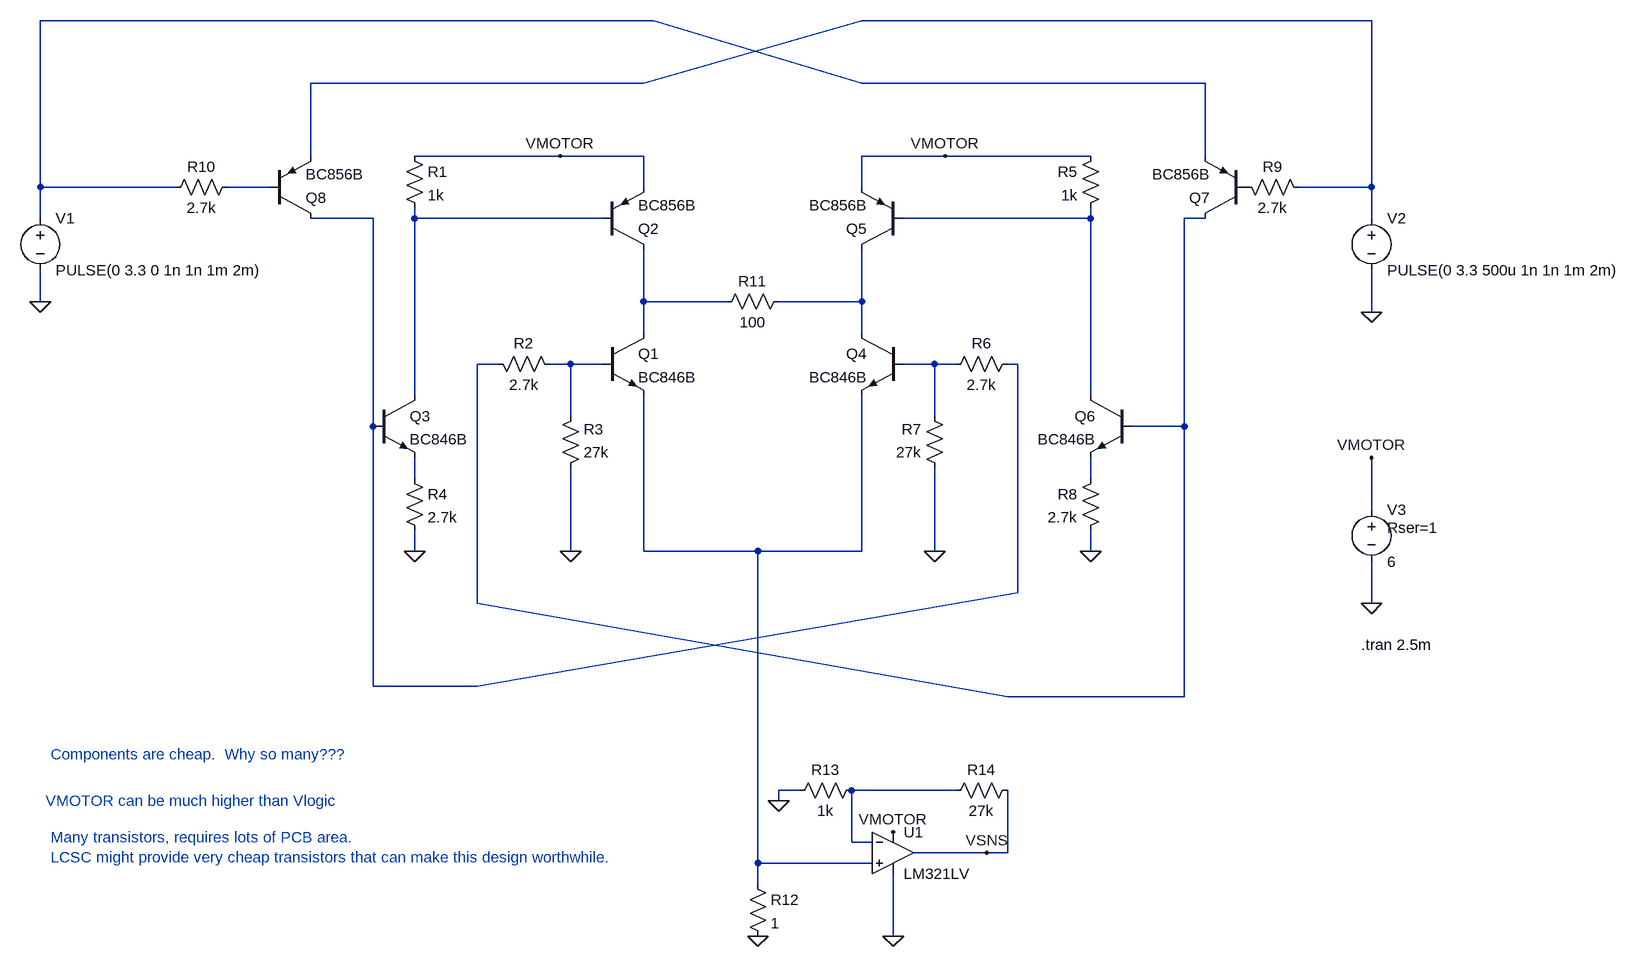
[diagram p0: schematic motor_driver.asc]
motor_driver.asc, the LTspice schematic file:
Version 4
SHEET 1 2836 1124
WIRE 208 -304 -736 -304
WIRE 1312 -304 528 -304
WIRE 192 -208 528 -304
WIRE 192 -208 -320 -208
WIRE 528 -208 208 -304
WIRE 1056 -208 528 -208
WIRE -320 -96 -320 -208
WIRE 64 -96 -160 -96
WIRE 192 -96 64 -96
WIRE 656 -96 528 -96
WIRE 880 -96 656 -96
WIRE 1056 -96 1056 -208
WIRE -736 -48 -736 -304
WIRE -528 -48 -736 -48
WIRE -384 -48 -448 -48
WIRE 192 -48 192 -96
WIRE 528 -48 528 -96
WIRE 1312 -48 1312 -304
WIRE 1312 -48 1200 -48
WIRE -736 0 -736 -48
WIRE -224 0 -320 0
WIRE -160 0 -160 -16
WIRE 128 0 -160 0
WIRE 880 0 880 -16
WIRE 880 0 592 0
WIRE 1056 0 1024 0
WIRE 1312 0 1312 -48
WIRE -736 128 -736 80
WIRE 192 128 192 48
WIRE 320 128 192 128
WIRE 528 128 528 48
WIRE 528 128 400 128
WIRE 1312 144 1312 80
WIRE 192 176 192 128
WIRE 528 176 528 128
WIRE -32 224 -64 224
WIRE 80 224 48 224
WIRE 128 224 80 224
WIRE 640 224 592 224
WIRE 672 224 640 224
WIRE 768 224 752 224
WIRE -160 272 -160 0
WIRE 880 272 880 0
WIRE 80 304 80 224
WIRE 640 304 640 224
WIRE -224 320 -224 0
WIRE 1024 320 1024 0
WIRE 1024 320 944 320
WIRE -160 400 -160 368
WIRE 880 400 880 368
WIRE 1312 448 1312 368
WIRE -160 512 -160 480
WIRE 80 512 80 384
WIRE 192 512 192 272
WIRE 368 512 192 512
WIRE 528 512 528 272
WIRE 528 512 368 512
WIRE 640 512 640 384
WIRE 880 512 880 480
WIRE 768 576 768 224
WIRE -64 592 -64 224
WIRE 1312 592 1312 528
WIRE -224 720 -224 320
WIRE -64 720 768 576
WIRE -64 720 -224 720
WIRE 752 736 -64 592
WIRE 1024 736 1024 320
WIRE 1024 736 752 736
WIRE 432 880 400 880
WIRE 672 880 512 880
WIRE 400 896 400 880
WIRE 512 960 512 880
WIRE 544 960 512 960
WIRE 720 976 608 976
WIRE 752 976 752 880
WIRE 752 976 720 976
WIRE 368 992 368 512
WIRE 544 992 368 992
WIRE 368 1024 368 992
WIRE 576 1104 576 1008
FLAG -160 512 0
FLAG 80 512 0
FLAG 64 -96 VMOTOR
FLAG 880 512 0
FLAG 640 512 0
FLAG 656 -96 VMOTOR
FLAG -736 128 0
FLAG 1312 144 0
FLAG 1312 592 0
FLAG 1312 368 VMOTOR
FLAG 368 1104 0
FLAG 576 1104 0
FLAG 576 944 VMOTOR
FLAG 400 896 0
FLAG 720 976 VSNS
SYMBOL npn 128 176 R0
SYMATTR InstName Q1
SYMATTR Value BC846B
SYMBOL pnp 128 48 M180
SYMATTR InstName Q2
SYMATTR Value BC856B
SYMBOL res -176 -112 R0
SYMATTR InstName R1
SYMATTR Value 1k
SYMBOL res -48 208 M90
WINDOW 0 0 56 VBottom 2
WINDOW 3 32 56 VTop 2
SYMATTR InstName R2
SYMATTR Value 2.7k
SYMBOL res 64 400 M180
WINDOW 0 36 76 Left 2
WINDOW 3 36 40 Left 2
SYMATTR InstName R3
SYMATTR Value 27k
SYMBOL npn -224 272 R0
SYMATTR InstName Q3
SYMATTR Value BC846B
SYMBOL res -176 384 R0
SYMATTR InstName R4
SYMATTR Value 2.7k
SYMBOL npn 592 176 M0
SYMATTR InstName Q4
SYMATTR Value BC846B
SYMBOL pnp 592 48 R180
SYMATTR InstName Q5
SYMATTR Value BC856B
SYMBOL res 896 -112 M0
SYMATTR InstName R5
SYMATTR Value 1k
SYMBOL res 768 208 R90
WINDOW 0 0 56 VBottom 2
WINDOW 3 32 56 VTop 2
SYMATTR InstName R6
SYMATTR Value 2.7k
SYMBOL res 656 400 R180
WINDOW 0 36 76 Left 2
WINDOW 3 36 40 Left 2
SYMATTR InstName R7
SYMATTR Value 27k
SYMBOL npn 944 272 M0
SYMATTR InstName Q6
SYMATTR Value BC846B
SYMBOL res 896 384 M0
SYMATTR InstName R8
SYMATTR Value 2.7k
SYMBOL pnp 1120 0 R180
SYMATTR InstName Q7
SYMATTR Value BC856B
SYMBOL res 1104 -64 M90
WINDOW 0 0 56 VBottom 2
WINDOW 3 32 56 VTop 2
SYMATTR InstName R9
SYMATTR Value 2.7k
SYMBOL pnp -384 0 M180
SYMATTR InstName Q8
SYMATTR Value BC856B
SYMBOL res -432 -64 R90
WINDOW 0 0 56 VBottom 2
WINDOW 3 32 56 VTop 2
SYMATTR InstName R10
SYMATTR Value 2.7k
SYMBOL res 416 112 R90
WINDOW 0 0 56 VBottom 2
WINDOW 3 32 56 VTop 2
SYMATTR InstName R11
SYMATTR Value 100
SYMBOL voltage -736 -16 R0
WINDOW 123 0 0 Left 0
WINDOW 39 0 0 Left 0
SYMATTR InstName V1
SYMATTR Value PULSE(0 3.3 0 1n 1n 1m 2m)
SYMBOL voltage 1312 -16 R0
WINDOW 123 0 0 Left 0
WINDOW 39 0 0 Left 0
SYMATTR InstName V2
SYMATTR Value PULSE(0 3.3 500u 1n 1n 1m 2m)
SYMBOL voltage 1312 432 R0
WINDOW 123 0 0 Left 0
WINDOW 39 24 44 Left 2
SYMATTR SpiceLine Rser=1
SYMATTR InstName V3
SYMATTR Value 6
SYMBOL res 352 1008 R0
SYMATTR InstName R12
SYMATTR Value 1
SYMBOL ZZZ\\OpAmp\\LM321LV 576 912 R0
SYMATTR InstName U1
SYMBOL res 528 864 R90
WINDOW 0 0 56 VBottom 2
WINDOW 3 32 56 VTop 2
SYMATTR InstName R13
SYMATTR Value 1k
SYMBOL res 768 864 R90
WINDOW 0 0 56 VBottom 2
WINDOW 3 32 56 VTop 2
SYMATTR InstName R14
SYMATTR Value 27k
TEXT 1296 656 Left 2 !.tran 2.5m
TEXT -728 896 Left 2 ;VMOTOR can be much higher than Vlogic
TEXT -720 952 Left 2 ;Many transistors, requires lots of PCB area.\nLCSC might provide very cheap transistors that can make this design worthwhile.
TEXT -720 824 Left 2 ;Components are cheap.  Why so many???

The netlist it stands for:
* motor_driver.asc
Q1 N008 N010 N014 0 BC846B
Q2 N008 N005 VMOTOR 0 BC856B
R1 VMOTOR N005 1k
R2 N007 N010 2.7k
R3 0 N010 27k
Q3 N005 N004 N012 0 BC846B
R4 N012 0 2.7k
Q4 N009 N011 N014 0 BC846B
Q5 N009 N006 VMOTOR 0 BC856B
R5 VMOTOR N006 1k
R6 N004 N011 2.7k
R7 0 N011 27k
Q6 N006 N007 N013 0 BC846B
R8 N013 0 2.7k
Q7 N007 P001 N001 0 BC856B
R9 P001 N002 2.7k
Q8 N004 N003 N002 0 BC856B
R10 N003 N001 2.7k
R11 N009 N008 100
V1 N001 0 PULSE(0 3.3 0 1n 1n 1m 2m)
V2 N002 0 PULSE(0 3.3 500u 1n 1n 1m 2m)
V3 VMOTOR 0 6 Rser=1
R12 N014 0 1
* U1: LM321LV (symbol ZZZ\OpAmp\LM321LV not available, pins judged from their places): In+=N014 In-=N015 V+=VMOTOR V-=0 OUT=VSNS
R13 N015 0 1k
R14 VSNS N015 27k
.model NPN NPN
.model PNP PNP
.lib standard.bjt
.tran 2.5m
* VMOTOR can be much higher than Vlogic
* Many transistors, requires lots of PCB area.
* LCSC might provide very cheap transistors that can make this design worthwhile.
* Components are cheap.  Why so many???
.backanno
.end